# Altium schematic sheet Translators.SchDoc: FMC_ADC
size 420 x 297 mm; Author: G.Kasprowicz; CompanyName: WUT ISE; DrawnBy: G.Kasprowicz; Organization: WUT ISE; Address1: PW ISE; Address2: Nowowiejska 15/19 00-665 Warsaw; Address3: gkasprow@gmail.com; DocumentNumber: 12; Revision: 2; SheetNumber: 12; SheetTotal: 12; ModifiedBy: -; CheckedDate: -; Title2: 100M_10B_16CHA_TDC; DivGrp: WUT ISE; Designer: G.Kasprowicz; ModifiedDate: -; ProjectName: Sensor Box
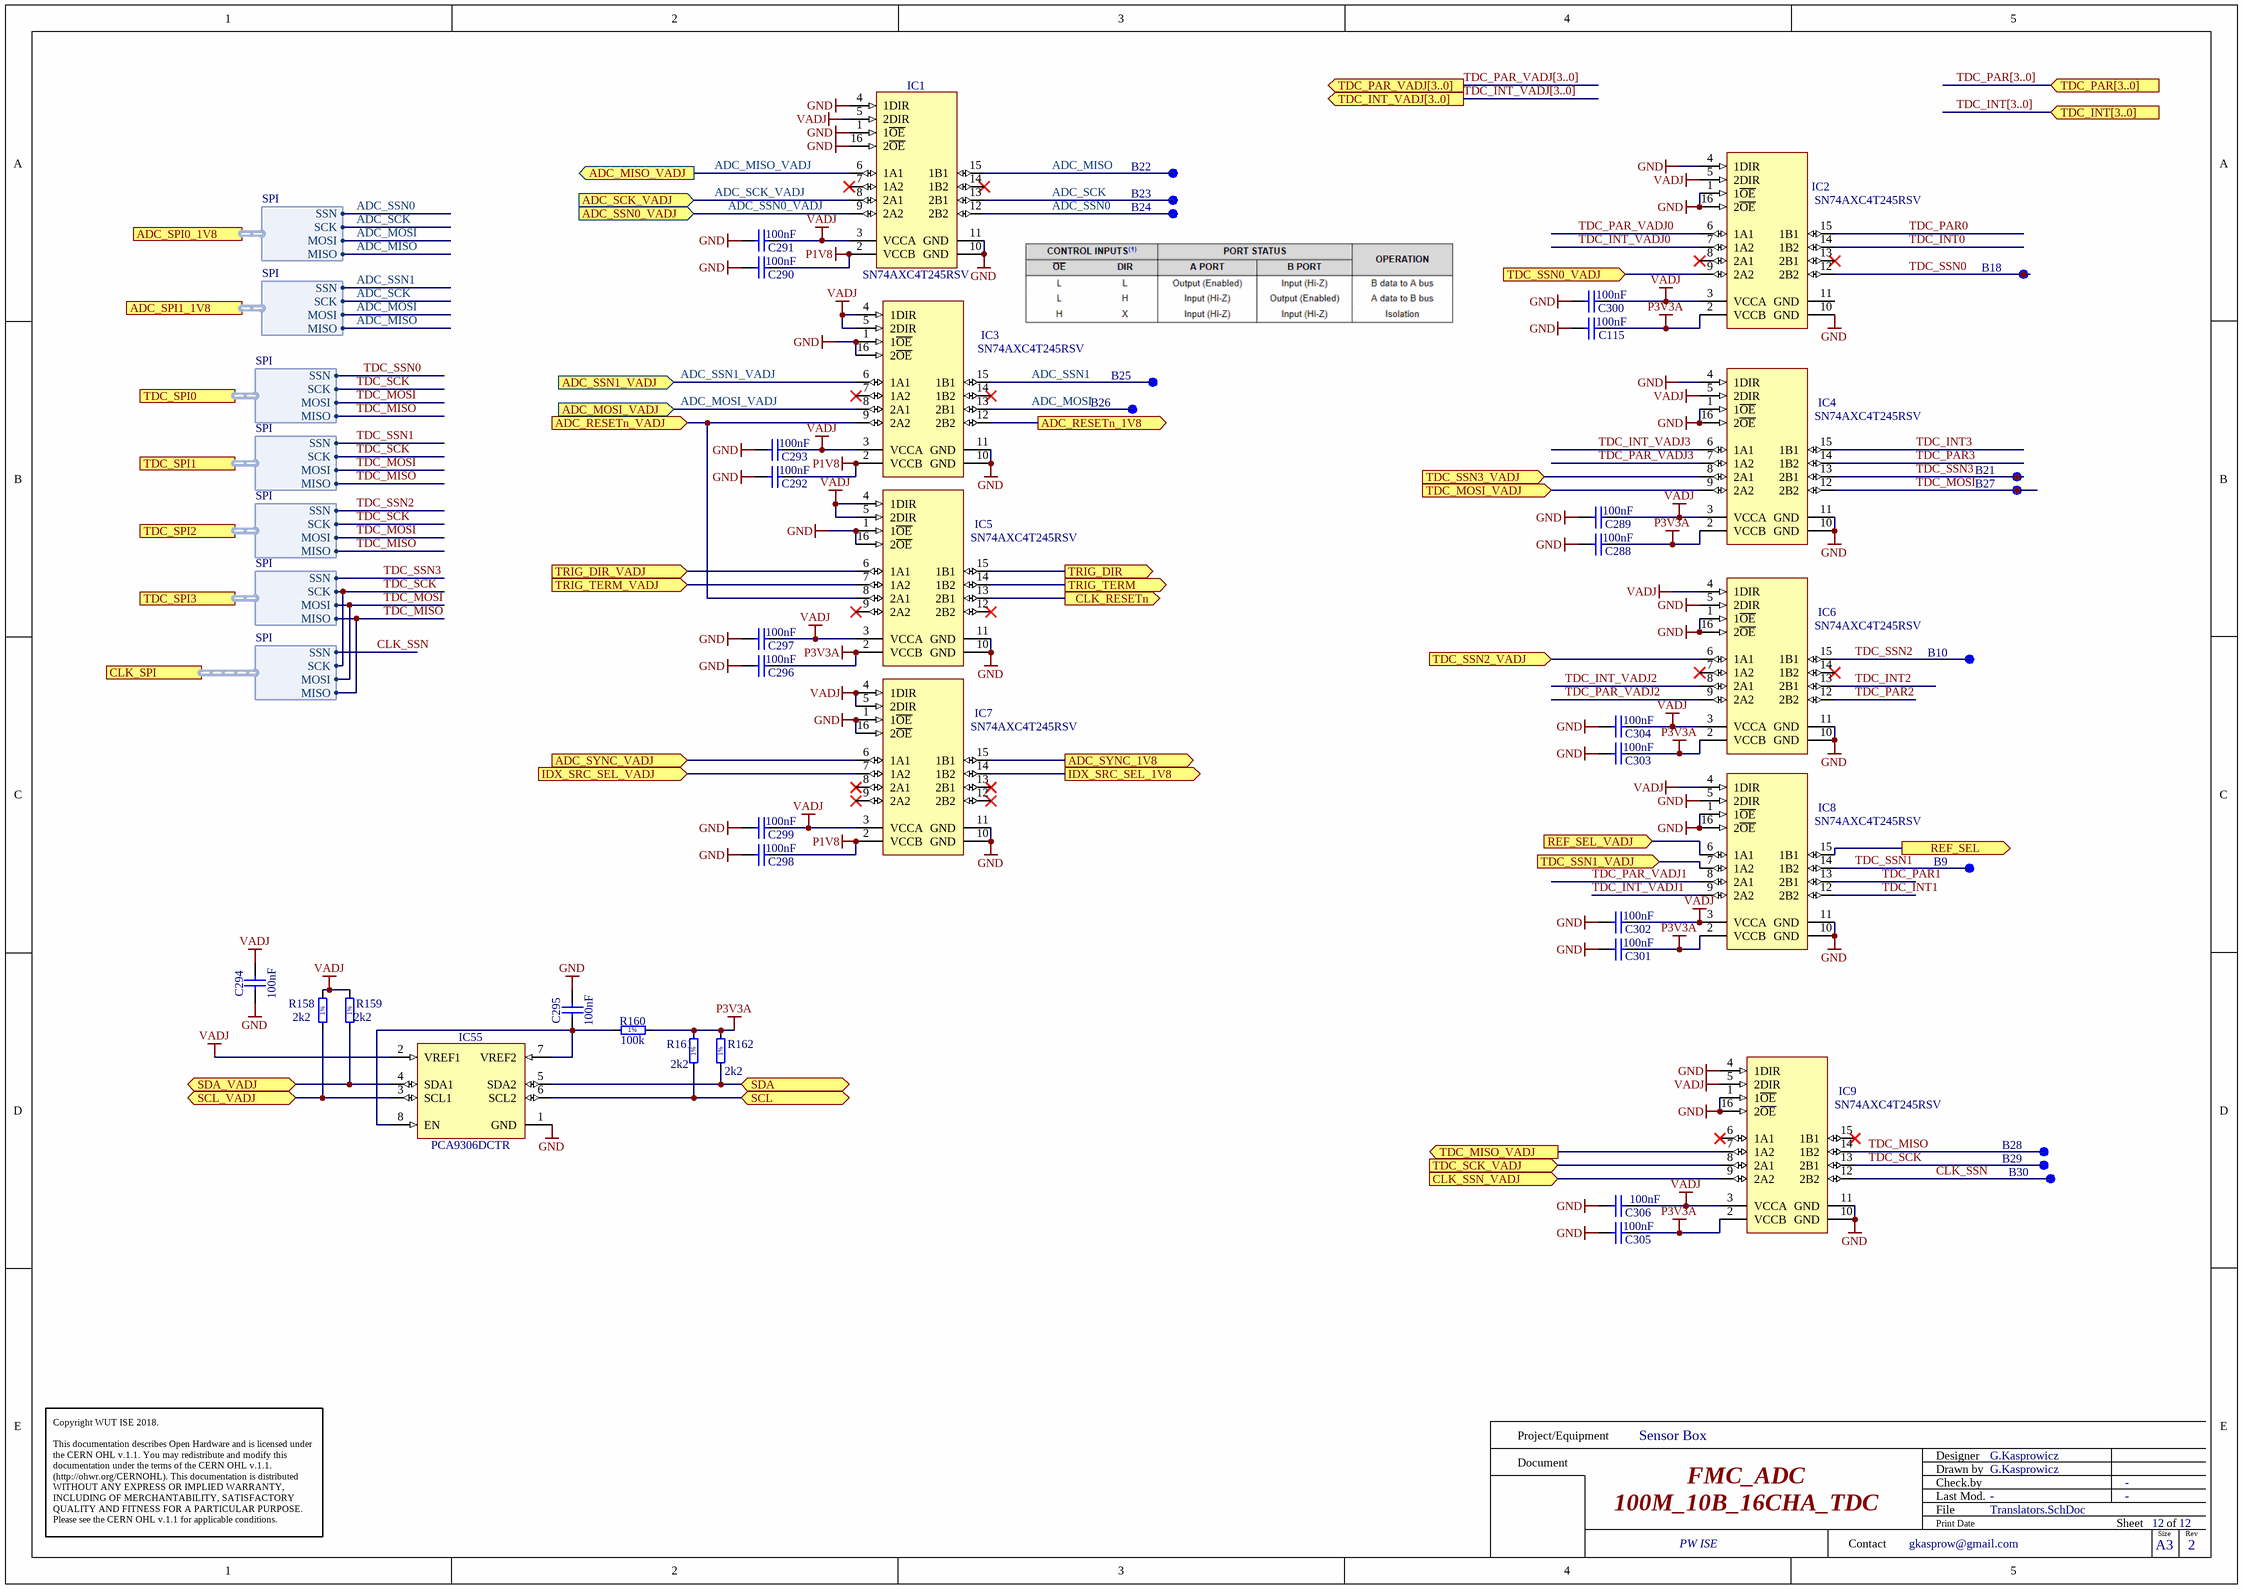
[diagram p0: Translators.SchDoc]

## Parts
B9  SMD Pad  [C100]  (value not drawn)
B10  SMD Pad  [C100]  (value not drawn)
B18  SMD Pad  [C100]  (value not drawn)
B21  SMD Pad  [C100]  (value not drawn)
B22  SMD Pad  [C100]  (value not drawn)
B23  SMD Pad  [C100]  (value not drawn)
B24  SMD Pad  [C100]  (value not drawn)
B25  SMD Pad  [C100]  (value not drawn)
B26  SMD Pad  [C100]  (value not drawn)
B27  SMD Pad  [C100]  (value not drawn)
B28  SMD Pad  [C100]  (value not drawn)
B29  SMD Pad  [C100]  (value not drawn)
B30  SMD Pad  [C100]  (value not drawn)
C115  100nF  [CAPC0603X33N]
C288  100nF  [CAPC0603X33N]
C289  100nF  [CAPC0603X33N]
C290  100nF  [CAPC0603X33N]
C291  100nF  [CAPC0603X33N]
C292  100nF  [CAPC0603X33N]
C293  100nF  [CAPC0603X33N]
C294  100nF  [CAPC0603X33N]
C295  100nF  [CAPC0603X33N]
C296  100nF  [CAPC0603X33N]
C297  100nF  [CAPC0603X33N]
C298  100nF  [CAPC0603X33N]
C299  100nF  [CAPC0603X33N]
C300  100nF  [CAPC0603X33N]
C301  100nF  [CAPC0603X33N]
C302  100nF  [CAPC0603X33N]
C303  100nF  [CAPC0603X33N]
C304  100nF  [CAPC0603X33N]
C305  100nF  [CAPC0603X33N]
C306  100nF  [CAPC0603X33N]
IC1  SN74AXC4T245RSV  [QFN40P180X260X55-16N]
IC2  SN74AXC4T245RSV  [QFN40P180X260X55-16N]
IC3  SN74AXC4T245RSV  [QFN40P180X260X55-16N]
IC4  SN74AXC4T245RSV  [QFN40P180X260X55-16N]
IC5  SN74AXC4T245RSV  [QFN40P180X260X55-16N]
IC6  SN74AXC4T245RSV  [QFN40P180X260X55-16N]
IC7  SN74AXC4T245RSV  [QFN40P180X260X55-16N]
IC8  SN74AXC4T245RSV  [QFN40P180X260X55-16N]
IC9  SN74AXC4T245RSV  [QFN40P180X260X55-16N]
IC55  PCA9306DCTR  [SOP65P400X130-8N]
R158  2k2  [RESC1005X40N]
R159  2k2  [RESC1005X40N]
R160  100k  [RESC1005X40N]
R161  2k2  [RESC1005X40N]
R162  2k2  [RESC1005X40N]

## Ports
ADC_MISO_VADJ (out), ADC_MOSI_VADJ (in), ADC_RESETn_1V8 (out), ADC_RESETn_VADJ (in), ADC_SCK_VADJ (in), ADC_SPI0_1V8 (harness SPI), ADC_SPI1_1V8 (harness SPI), ADC_SSN0_VADJ (in), ADC_SSN1_VADJ (in), ADC_SYNC_1V8 (out), ADC_SYNC_VADJ (in), CLK_RESETn (out), CLK_SPI (harness SPI), CLK_SSN_VADJ (in), IDX_SRC_SEL_1V8 (out), IDX_SRC_SEL_VADJ (in), REF_SEL (out), REF_SEL_VADJ (in), SCL (bidir), SCL_VADJ (bidir), SDA (bidir), SDA_VADJ (bidir), TDC_INT[3..0] (in), TDC_INT_VADJ[3..0] (out), TDC_MISO_VADJ (out), TDC_MOSI_VADJ (in), TDC_PAR[3..0] (in), TDC_PAR_VADJ[3..0] (out), TDC_SCK_VADJ (in), TDC_SPI0 (harness SPI), TDC_SPI1 (harness SPI), TDC_SPI2 (harness SPI), TDC_SPI3 (harness SPI), TDC_SSN0_VADJ (in), TDC_SSN1_VADJ (in), TDC_SSN2_VADJ (in), TDC_SSN3_VADJ (in), TRIG_DIR (out), TRIG_DIR_VADJ (in), TRIG_TERM (out), TRIG_TERM_VADJ (in)

## Harnesses
SPI: MISO, MOSI, SCK, SSN

## Nets
GND: C115.2 C288.2 C289.2 C290.2 C291.2 C292.2 C293.2 C294.1 C295.2 C296.2 C297.2 C298.2 C299.2 C300.2 C301.2 C302.2 C303.2 C304.2 C305.2 C306.2 IC1.1(1~{OE}) IC1.4(1DIR) IC1.10(GND) IC1.11(GND) IC1.16(2~{OE}) IC2.1(1~{OE}) IC2.4(1DIR) IC2.10(GND) IC2.16(2~{OE}) IC3.1(1~{OE}) IC3.10(GND) IC3.11(GND) IC3.16(2~{OE}) IC4.1(1~{OE}) IC4.4(1DIR) IC4.10(GND) IC4.11(GND) IC4.16(2~{OE}) IC5.1(1~{OE}) IC5.10(GND) IC5.11(GND) IC5.16(2~{OE}) IC6.1(1~{OE}) IC6.5(2DIR) IC6.10(GND) IC6.11(GND) IC6.16(2~{OE}) IC7.1(1~{OE}) IC7.10(GND) IC7.11(GND) IC7.16(2~{OE}) IC8.1(1~{OE}) IC8.5(2DIR) IC8.10(GND) IC8.11(GND) IC8.16(2~{OE}) IC9.1(1~{OE}) IC9.4(1DIR) IC9.10(GND) IC9.11(GND) IC9.16(2~{OE}) IC55.1(GND)
P1V8: C290.1 C292.1 C298.1 IC1.2(VCCB) IC3.2(VCCB) IC7.2(VCCB)
P3V3A: C115.1 C288.1 C296.1 C301.1 C303.1 C305.1 IC2.2(VCCB) IC4.2(VCCB) IC5.2(VCCB) IC6.2(VCCB) IC8.2(VCCB) IC9.2(VCCB) R160.2 R161.2 R162.2
VADJ: C289.1 C291.1 C293.1 C294.2 C297.1 C299.1 C300.1 C302.1 C304.1 C306.1 IC1.3(VCCA) IC1.5(2DIR) IC2.3(VCCA) IC2.5(2DIR) IC3.3(VCCA) IC3.4(1DIR) IC3.5(2DIR) IC4.3(VCCA) IC4.5(2DIR) IC5.3(VCCA) IC5.4(1DIR) IC5.5(2DIR) IC6.3(VCCA) IC6.4(1DIR) IC7.3(VCCA) IC7.4(1DIR) IC7.5(2DIR) IC8.3(VCCA) IC8.4(1DIR) IC9.3(VCCA) IC9.5(2DIR) IC55.2(VREF1) R158.2 R159.2
ADC_MISO: B22.1 IC1.15(1B1) ; port ADC_SPI0_1V8.MISO, port ADC_SPI1_1V8.MISO
ADC_MISO_VADJ: IC1.6(1A1) ; port ADC_MISO_VADJ
ADC_MOSI: B26.1 IC3.13(2B1) ; port ADC_SPI0_1V8.MOSI, port ADC_SPI1_1V8.MOSI
ADC_MOSI_VADJ: IC3.8(2A1) ; port ADC_MOSI_VADJ
ADC_RESETn_1V8: IC3.12(2B2) ; port ADC_RESETn_1V8
ADC_RESETn_VADJ: IC3.9(2A2) IC5.8(2A1) ; port ADC_RESETn_VADJ
ADC_SCK: B23.1 IC1.13(2B1) ; port ADC_SPI0_1V8.SCK, port ADC_SPI1_1V8.SCK
ADC_SCK_VADJ: IC1.8(2A1) ; port ADC_SCK_VADJ
ADC_SSN0: B24.1 IC1.12(2B2) ; port ADC_SPI0_1V8.SSN
ADC_SSN0_VADJ: IC1.9(2A2) ; port ADC_SSN0_VADJ
ADC_SSN1: B25.1 IC3.15(1B1) ; port ADC_SPI1_1V8.SSN
ADC_SSN1_VADJ: IC3.6(1A1) ; port ADC_SSN1_VADJ
ADC_SYNC_1V8: IC7.15(1B1) ; port ADC_SYNC_1V8
ADC_SYNC_VADJ: IC7.6(1A1) ; port ADC_SYNC_VADJ
CLK_RESETn: IC5.13(2B1) ; port CLK_RESETn
CLK_SSN: B30.1 IC9.12(2B2) ; port CLK_SPI.SSN
CLK_SSN_VADJ: IC9.9(2A2) ; port CLK_SSN_VADJ
IDX_SRC_SEL_1V8: IC7.14(1B2) ; port IDX_SRC_SEL_1V8
IDX_SRC_SEL_VADJ: IC7.7(1A2) ; port IDX_SRC_SEL_VADJ
REF_SEL: IC8.15(1B1) ; port REF_SEL
REF_SEL_VADJ: IC8.6(1A1) ; port REF_SEL_VADJ
SCL: IC55.6(SCL2) R161.1 ; port SCL
SCL_VADJ: IC55.3(SCL1) R158.1 ; port SCL_VADJ
SDA: IC55.5(SDA2) R162.1 ; port SDA
SDA_VADJ: IC55.4(SDA1) R159.1 ; port SDA_VADJ
TDC_INT0: IC2.14(1B2)
TDC_INT1: IC8.12(2B2)
TDC_INT2: IC6.13(2B1)
TDC_INT3: IC4.15(1B1)
TDC_INT_VADJ0: IC2.7(1A2)
TDC_INT_VADJ1: IC8.9(2A2)
TDC_INT_VADJ2: IC6.8(2A1)
TDC_INT_VADJ3: IC4.6(1A1)
TDC_MISO: B28.1 IC9.14(1B2) ; port TDC_SPI0.MISO, port TDC_SPI1.MISO, port TDC_SPI2.MISO, port TDC_SPI3.MISO, port CLK_SPI.MISO
TDC_MISO_VADJ: IC9.7(1A2) ; port TDC_MISO_VADJ
TDC_MOSI: B27.1 IC4.12(2B2) ; port TDC_SPI0.MOSI, port TDC_SPI1.MOSI, port TDC_SPI2.MOSI, port TDC_SPI3.MOSI, port CLK_SPI.MOSI
TDC_MOSI_VADJ: IC4.9(2A2) ; port TDC_MOSI_VADJ
TDC_PAR0: IC2.15(1B1)
TDC_PAR1: IC8.13(2B1)
TDC_PAR2: IC6.12(2B2)
TDC_PAR3: IC4.14(1B2)
TDC_PAR_VADJ0: IC2.6(1A1)
TDC_PAR_VADJ1: IC8.8(2A1)
TDC_PAR_VADJ2: IC6.9(2A2)
TDC_PAR_VADJ3: IC4.7(1A2)
TDC_SCK: B29.1 IC9.13(2B1) ; port TDC_SPI0.SCK, port TDC_SPI1.SCK, port TDC_SPI2.SCK, port TDC_SPI3.SCK, port CLK_SPI.SCK
TDC_SCK_VADJ: IC9.8(2A1) ; port TDC_SCK_VADJ
TDC_SSN0: B18.1 IC2.12(2B2) ; port TDC_SPI0.SSN
TDC_SSN0_VADJ: IC2.9(2A2) ; port TDC_SSN0_VADJ
TDC_SSN1: B9.1 IC8.14(1B2) ; port TDC_SPI1.SSN
TDC_SSN1_VADJ: IC8.7(1A2) ; port TDC_SSN1_VADJ
TDC_SSN2: B10.1 IC6.15(1B1) ; port TDC_SPI2.SSN
TDC_SSN2_VADJ: IC6.6(1A1) ; port TDC_SSN2_VADJ
TDC_SSN3: B21.1 IC4.13(2B1) ; port TDC_SPI3.SSN
TDC_SSN3_VADJ: IC4.8(2A1) ; port TDC_SSN3_VADJ
TRIG_DIR: IC5.15(1B1) ; port TRIG_DIR
TRIG_DIR_VADJ: IC5.6(1A1) ; port TRIG_DIR_VADJ
TRIG_TERM: IC5.14(1B2) ; port TRIG_TERM
TRIG_TERM_VADJ: IC5.7(1A2) ; port TRIG_TERM_VADJ
NetC295_1: C295.1 IC55.7(VREF2) IC55.8(EN) R160.1

Not connected (* = marked no-connect by the designer): IC1 7(1A2)* 14(1B2)*; IC2 8(2A1)* 11(GND) 13(2B1)*; IC3 7(1A2)* 14(1B2)*; IC5 9(2A2)* 12(2B2)*; IC6 7(1A2)* 14(1B2)*; IC7 8(2A1)* 9(2A2)* 12(2B2)* 13(2B1)*; IC9 6(1A1)* 15(1B1)*

## Buses and harness runs
bus TDC_INT[3..0] = port TDC_INT[3..0]
bus TDC_INT_VADJ[3..0] = port TDC_INT_VADJ[3..0]
bus TDC_PAR[3..0] = port TDC_PAR[3..0]
bus TDC_PAR_VADJ[3..0] = port TDC_PAR_VADJ[3..0]

## Notes on the sheet
- Project/Equipment
- Document
- Designer
- Drawn by
- Check.by
- Copyright WUT ISE 2018.
  This documentation describes Open Hardware and is licensed under the CERN OHL v.1.1. You may redistribute and modify this documentation under the terms of the CERN OHL v.1.1. (http://ohwr.org/CERNOHL). This documentation is distributed WITHOUT ANY EXPRESS OR IMPLIED WARRANTY, INCLUDING OF MERCHANTABILITY, SATISFACTORY QUALITY AND FITNESS FOR A PARTICULAR PURPOSE. Please see the CERN OHL v.1.1 for applicable conditions.
- Contact
- File
- Last Mod.
- Print Date
- Sheet
- Size
- A3
- of
- Rev
- (in symbol R0402_2K2_1%_0.0625W_100PPM) 1%
- (in symbol R0402_100K_1%_0.0625W_100PPM) 1%

## Library data of the parts
B9 B10 B18 B21-B30 = SMD_PAD_D1MM: Through Hole Pad; Part Description: 1mm Diameter SMD Pad; Mounted: No; Part Number: SMD_PAD_D1MM; Component Kind: Standard (No BOM); Component Type: Standard (No BOM); Pin Count: 1; Family: SMD Pad; Socket: No; SMD: No; Sense: No; Status: None; ComponentHeight: 0mm; HelpURL: Undefined; Author: CERN DEM JLC; CreateDate: 10.10.2017; LatestRevisionDate: 10.10.2017; PackageDescription: 1mm Diameter SMD Pad
C115 C288-C306 = CC0201_100NF_6.3V_10%_X5R: Non-polarised capacitor; Manufacturer: GENERIC; Part Description: SMD Multilayer Chip Ceramic Capacitor; Manufacturer1 Part Number: 02016D104KAT2A; Tolerance: ±10%; Voltage: 6.3V; TC: X5R; Manufacturer Part Number: CC0201_100NF_6.3V_10%_X5R; Part Number: CC0201_100NF_6.3V_10%_X5R; Value: 100nF; Component Kind: Standard; Component Type: Standard; Pin Count: 2; Status: Not Recommended; Case: 0201; Mounted: Yes; Socket: No; SMD: Yes; Sense: No; Manufacturer1 Example: AVX; Manufacturer1 ComponentHeight: 0.33mm; HelpURL: \\cern.ch\dfs\Applications\Altium\Datasheets\CC0201_X5R_AVX.pdf; Author: CERN DEM JLC; CreateDate: 03.12.2007; LatestRevisionDate: 03.12.2007
IC1-IC9 = SN74AXC4T245: 4-Bit Dual-Supply Bus Transceiver with Configurable Voltage Translation and 3-State Output; Part Description: 4-Bit Dual-Supply Bus Transceiver With Configurable Voltage Translation and 3-State Outputs; Manufacturer: TEXAS INSTRUMENTS; PressFit: No; Bonding: No; Part Number: SN74AXC4T245RSV; Component Kind: Standard; Component Type: Standard; Device: SN74AXC4T245RSV; PackageDescription: QFN, 0.40mm Pitch, Rect.; 16 Pin, 2.60mm L X 1.80mm W X 0.55mm H Body, IPC Medium Density; Status: Recommended; Manufacturer Part Number: SN74AXC4T245RSV; Pin Count: 16; Case: QFN16; Mounted: Yes; Socket: No; SMD: Yes; Sense: No; ComponentHeight: 0.55mm; Author: GK; HelpURL: \\cern.ch\dfs\Applications\Altium\Datasheets\SN74AVC4T245RSVR.pdf; CreateDate: 08.07.2014; LatestRevisionDate: 30.03.2017
IC55 = PCA9306DCTR: Dual Bidirectional I2C Bus And SMBus Voltage-Level Translator; Manufacturer: TEXAS INSTRUMENTS; Table: Analog & Interface; Part Number: PCA9306DCTR; Component Kind: Standard; Component Type: Standard; Device: PCA9306DCTR; PackageDescription: SOP, 0.65mm, Pitch; 8 Pin, 2.80mm W X 2.95mm L X 1.30mm H Body, PC Medium Density; Part Description: Dual Bidirectional I2C Bus And SMBus Voltage-Level Translator; Manufacturer Part Number: PCA9306DCTR; Pin Count: 8; Case: SSOP8; Mounted: Yes; Socket: No; SMD: Yes; ComponentHeight: 1.3mm; Author: CERN DEM JLC; HelpURL: \\cern.ch\dfs\Applications\Altium\Datasheets\PCA9306DCTR.pdf; CreateDate: 2013-02-25; LatestRevisionDate: 2013-02-25
R158 R159 R161 R162 = R0402_2K2_1%_0.0625W_100PPM: Resistor - 1%; Part Description: General Purpose Thick Film Chip Resistor; Manufacturer: GENERIC; Manufacturer1 Part Number: 232270672202L; TC: ±100ppm/°C; Table: Resistors SMD; Part Number: R0402_2K2_1%_0.0625W_100PPM; Component Kind: Standard; Component Type: Standard; Pin Count: 2; Value: 2k2; Status: Not recommended; Power: 0.0625W; Tolerance: ±1%; Manufacturer Part Number: R0402_2K2_1%_0.0625W_100PPM; Case: 0402; Mounted: Yes; Socket: No; SMD: Yes; Manufacturer1 Example: YAGEO PHYCOMP; Manufacturer1 ComponentHeight: 0.4mm; HelpURL: \\cern.ch\dfs\Applications\Altium\Datasheets\R0402_Phycomp_RC0402.pdf; Author: CERN DEM JLC; CreateDate: 2007-12-03; LatestRevisionDate: 2012-10-17
R160 = R0402_100K_1%_0.0625W_100PPM: Resistor - 1%; Part Description: General Purpose Thick Film Chip Resistor; Manufacturer: GENERIC; Manufacturer1 Part Number: 232270671004L; TC: ±100ppm/°C; Table: Resistors SMD; Part Number: R0402_100K_1%_0.0625W_100PPM; Component Kind: Standard; Component Type: Standard; Pin Count: 2; Value: 100k; Status: Not recommended; Power: 0.0625W; Tolerance: ±1%; Manufacturer Part Number: R0402_100K_1%_0.0625W_100PPM; Case: 0402; Mounted: Yes; Socket: No; SMD: Yes; Manufacturer1 Example: YAGEO PHYCOMP; Manufacturer1 ComponentHeight: 0.4mm; HelpURL: \\cern.ch\dfs\Applications\Altium\Datasheets\R0402_Phycomp_RC0402.pdf; Author: CERN DEM JLC; CreateDate: 2007-12-03; LatestRevisionDate: 2012-10-17